# EAGLE design Conn_pcb (EAGLE 9.1.0)
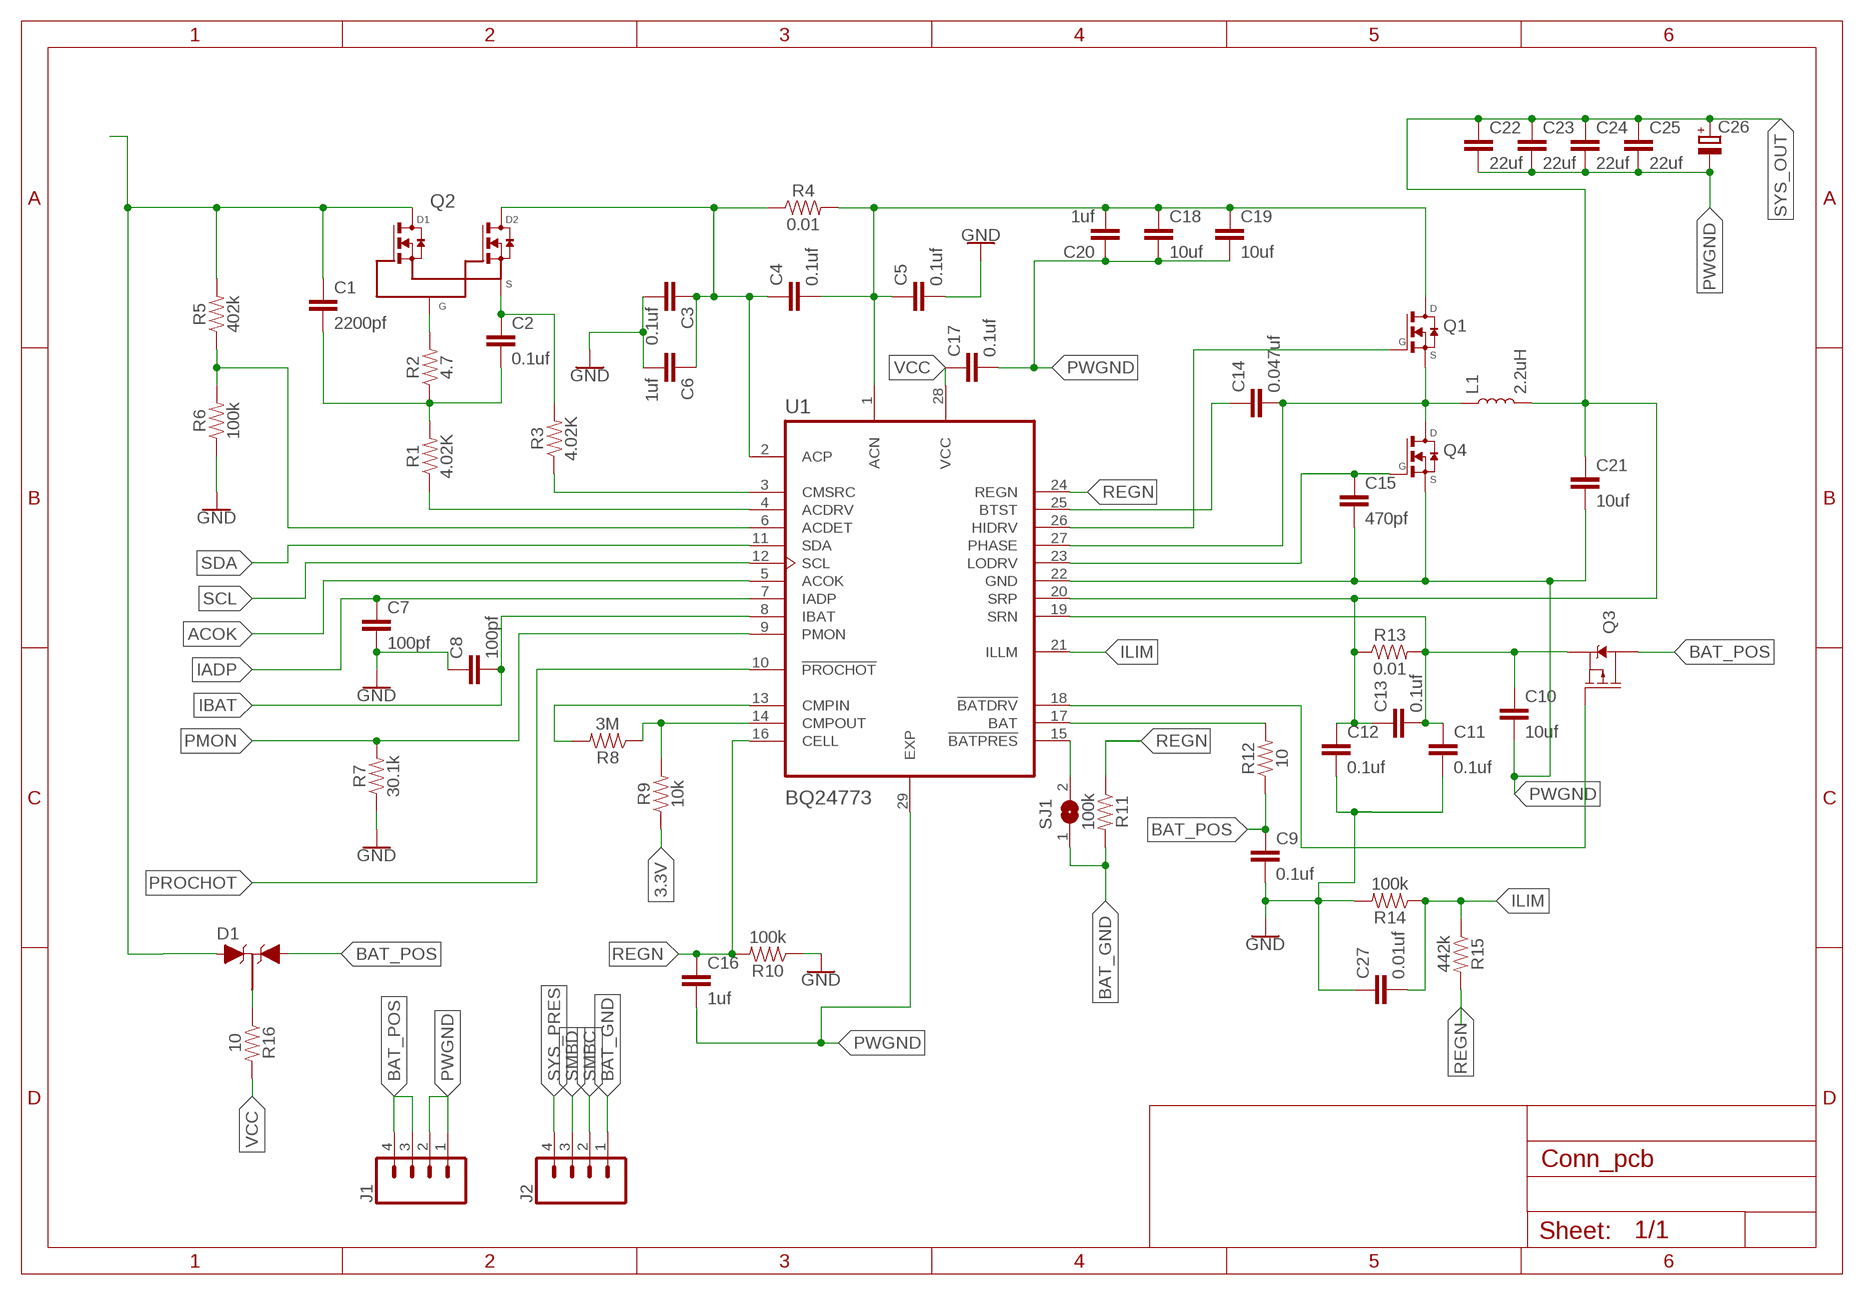
[diagram p0: schematic, sheet 1]

## Parts
C1  2200pf  CAP0402  [CAPC1005X50]
C2  0.1uf  CAP0402  [CAPC1005X50]
C3  0.1uf  CAP0402  [CAPC1005X50]
C4  0.1uf  CAP0402  [CAPC1005X50]
C5  0.1uf  CAP0402  [CAPC1005X50]
C6  1uf  CAP0402  [CAPC1005X50]
C7  100pf  CAP0402  [CAPC1005X50]
C8  100pf  CAP0402  [CAPC1005X50]
C9  0.1uf  CAP0402  [CAPC1005X50]
C10  10uf  C-EUC0805K  [C0805K]
C11  0.1uf  CAP0402  [CAPC1005X50]
C12  0.1uf  CAP0402  [CAPC1005X50]
C13  0.1uf  CAP0402  [CAPC1005X50]
C14  0.047uf  CAP0402  [CAPC1005X50]
C15  470pf  CAP0402  [CAPC1005X50]
C16  1uf  CAP0402  [CAPC1005X50]
C17  0.1uf  CAP0402  [CAPC1005X50]
C18  10uf  C-EUC0805K  [C0805K]
C19  10uf  C-EUC0805K  [C0805K]
C20  1uf  CAP0402  [CAPC1005X50]
C21  10uf  C-EUC0805K  [C0805K]
C22  22uf  C-EUC1206  [C1206]
C23  22uf  C-EUC1206  [C1206]
C24  22uf  C-EUC1206  [C1206]
C25  22uf  C-EUC1206  [C1206]
C26  CPOL-EUF  [PANASONIC_F]
C27  0.01uf  CAP0402  [CAPC1005X50]
D1  BAT54C-7-F  [SOT95P235X110-3]
J1  CONN_041.3  [1X04_NO_SILK_1.3]
J2  CONN_041.3  [1X04_NO_SILK_1.3]
L1  2.2uH  XEL6060-222MEB  [RESM6365X610]
Q1  CSD17308Q3  [SON65P330X330X110-8]
Q2  CSD87312Q3EVSON  [QFN65P330X330X100-12]
Q3  CSD25402Q3A  [CSD25402Q3A]
Q4  CSD17308Q3  [SON65P330X330X110-8]
R1  4.02K  RES4K04020402  [0402]
R2  4.7  RES4K04020402  [0402]
R3  4.02K  RES4K04020402  [0402]
R4  0.01  SENSE-RES  [1206]
R5  402k  RES4K04020402  [0402]
R6  100k  RES4K04020402  [0402]
R7  30.1k  RES4K04020402  [0402]
R8  3M  RES4K04020402  [0402]
R9  10k  RES4K04020402  [0402]
R10  100k  RES4K04020402  [0402]
R11  100k  RES4K04020402  [0402]
R12  10  RES4K04020402  [0402]
R13  0.01  SENSE-RES  [1206]
R14  100k  RES4K04020402  [0402]
R15  442k  RES4K04020402  [0402]
R16  10  RES4K04020402  [0402]
SJ1  SJ  [SJ]
U1  BQ24773  [QFN40P400X400X80-29T240]

## Nets
3.3V: R9.1
ACOK: U1.5(ACOK)
BAT_GND: J2.1 R11.2 SJ1.1
BAT_POS: C9.1 D1.2(A2) J1.3 J1.4 Q3.1(D) Q3.2(D) Q3.3(D) R12.1
GND: C3.2 C5.2 C6.2 C7.2 C8.1 C9.2 C11.2 C12.2 C27.1 R6.1 R7.1 R10.1 R14.2
IADP: C7.1 U1.7(IADP)
IBAT: C8.2 U1.8(IBAT)
ILIM: C27.2 R14.1 R15.1 U1.21(ILLM)
N$1: R1.1 U1.4(ACDRV)
N$2: C1.2 C2.2 R1.2 R2.1
N$3: Q2.5(G) R2.2
N$4: C1.1 D1.1(A1) Q2.1(D1) Q2.3(D1) Q2.4(D1) R5.2
N$5: R5.1 R6.2 U1.6(ACDET)
N$6: C4.2 C5.1 C18.1 C19.1 C20.2 Q1.5(D) Q1.6(D) Q1.7(D) Q1.8(D) R4.2 U1.1(ACN)
N$7: C2.1 Q2.9(S) Q2.9.1(S) Q2.9.2(S) Q2.9.3(S) Q2.9.4(S) R3.2
N$8: R3.1 U1.3(CMSRC)
N$9: C3.1 C4.1 C6.1 Q2.6(D2) Q2.7(D2) Q2.8(D2) R4.1 U1.2(ACP)
N$10: R8.2 U1.13(CMPIN)
N$11: R8.1 R9.2 U1.14(CMPOUT)
N$12: R12.2 U1.17(BAT)
N$13: Q3.4(G) U1.18(!BATDRV)
N$14: C10.1 C11.1 C13.2 Q3.5(S) Q3.6(S) Q3.7(S) Q3.8(S) Q3.9(S) R13.2 U1.19(SRN)
N$15: C15.1 Q4.4(G) U1.23(LODRV)
N$16: SJ1.2 U1.15(!BATPRES)
N$17: D1.3(K) R16.1
N$18: C14.2 L1.1 Q1.1(S) Q1.2(S) Q1.3(S) Q4.5(D) Q4.6(D) Q4.7(D) Q4.8(D) U1.27(PHASE)
N$19: C14.1 U1.25(BTST)
N$20: Q1.4(G) U1.26(HIDRV)
PMON: R7.2 U1.9(PMON)
PROCHOT: U1.10(!PROCHOT)
PWGND: C10.2 C15.2 C16.2 C17.2 C18.2 C19.2 C20.1 C21.2 C22.2 C23.2 C24.2 C25.2 C26.- J1.1 J1.2 Q4.1(S) Q4.2(S) Q4.3(S) U1.22(GND) U1.29(EXP)
REGN: C16.1 R10.2 R11.1 R15.2 U1.16(CELL) U1.24(REGN)
SCL: U1.12(SCL)
SDA: U1.11(SDA)
SMBC: J2.2
SMBD: J2.3
SYS_OUT: C12.1 C13.1 C21.1 C22.1 C23.1 C24.1 C25.1 C26.+ L1.2 R13.1 U1.20(SRP)
SYS_PRES: J2.4
VCC: C17.1 R16.2 U1.28(VCC)

## Library data of the parts
C1-C9 C11-C17 C20 C27 = BMS:CAP0402
C10 C18 C19 C21-C25 = rcl:C-EU: CAPACITOR, European symbol; SPICEPREFIX: C
C26 = rcl:CPOL-EU: POLARIZED CAPACITOR, European symbol; SPICEPREFIX: C
D1 = BMS:BAT54C-7-F
J1 J2 = SparkFun-Connectors:CONN_04: Multi connection point. Often used as Generic Header-pin footprint for 0.1 inch spaced/style header connections On any of the 0.1 inch spaced packages, you can populate with these: Break Away Headers - Straight <https://www.sparkfun.com/products/116> (PRT-00116) Break Away Male Headers - Right Angle <https://www.sparkfun.com/products/553> (PRT-00553) Female Headers <https://www.sparkfun.com/products/115> (PRT-00115) Break Away Headers - Machine Pin <https://www.sparkfun.com/products/117> (PRT-00117) Break Away Female Headers - Swiss Machine Pin <https://www.sparkfun.com/products/743> (PRT-00743) For SCREWTERMINALS and SPRING TERMINALS visit here: Screw Terimnals on SparkFun.com <https://www.sparkfun.com/search/results?term=Screw+Terminals> (5mm/3.5mm/2.54mm spacing) This device is also useful as a general connection point to wire up your design to another part of your project. Our various solder wires solder well into these plated through hole pads. Hook-Up Wire - Assortment (Stranded, 22 AWG) <https://www.sparkfun.com/products/11375> (PRT-11375) Hook-Up Wire - Assortment (Solid Core, 22 AWG) <https://www.sparkfun.com/products/11367> (PRT-11367) View the entire wire category on our website here <https://www.sparkfun.com/categories/141> Special notes: Molex polarized connector foot print use with SKU : PRT-08231 with associated crimp pins and housings. 1MM SMD Version SKU: PRT-10208
L1 = BMS:XEL6060-222MEB
Q1 Q4 = BMS:CSD17308Q3; SPICEPREFIX: Q
Q2 = BMS:CSD87312Q3E
Q3 = CSD25402Q3A:CSD25402Q3A; MANUFACTURER_PART_NUMBER: CSD25402Q3A; VENDOR: Texas Instruments
R1-R3 R5-R12 R14-R16 = BMS:RES4K0402
R4 R13 = BMS:SENSE-RES
SJ1 = jumper:SJ: SMD solder JUMPER
U1 = BMS:BQ24773

## Board
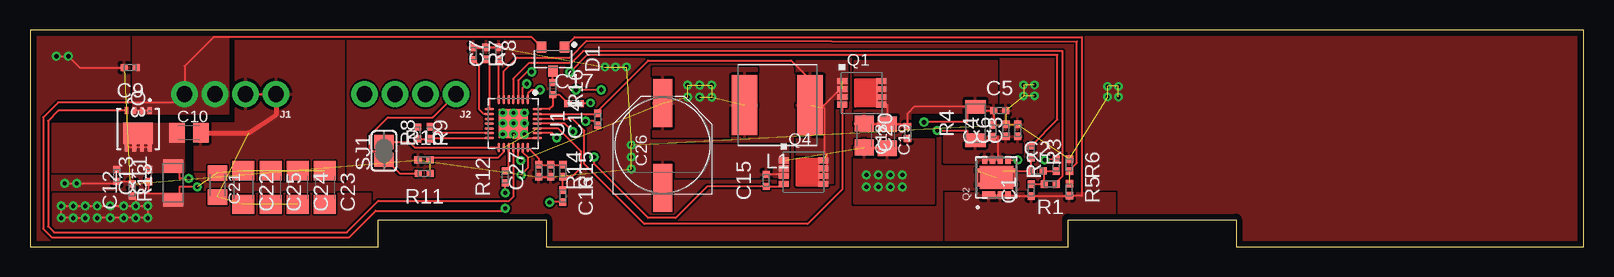
[diagram p1: board, top side]
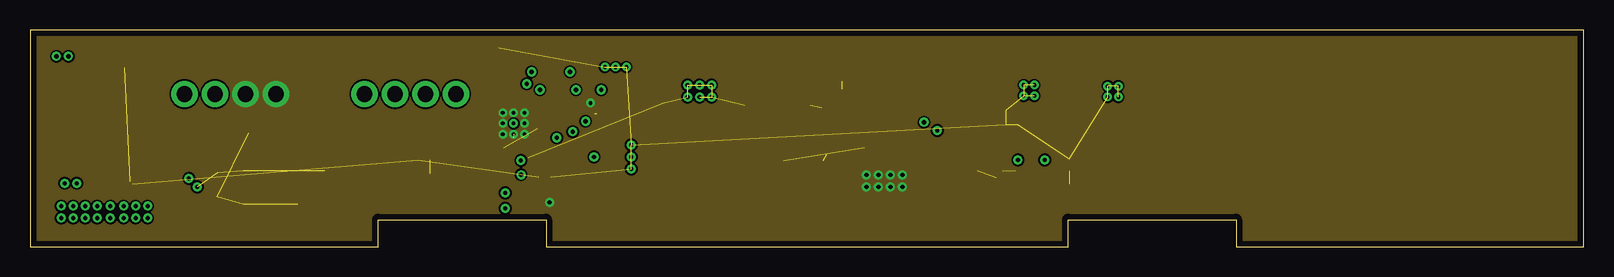
[diagram p2: board, inner layer Route2]
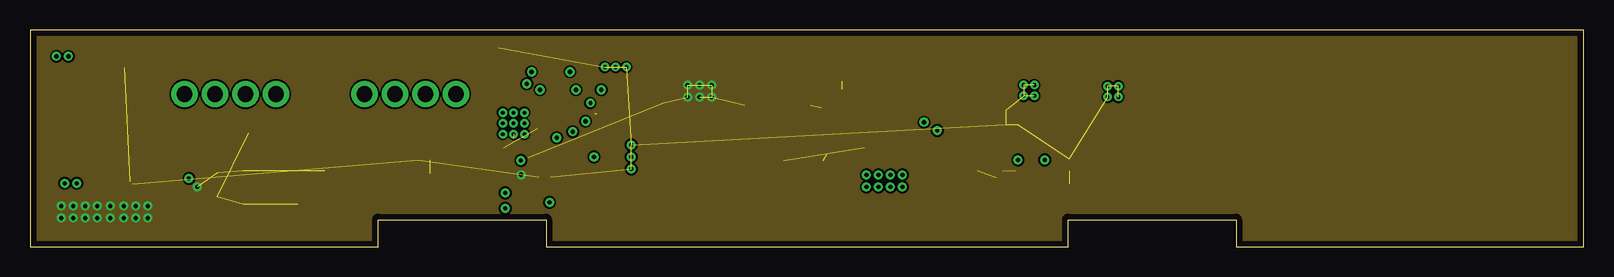
[diagram p3: board, inner layer Route15]
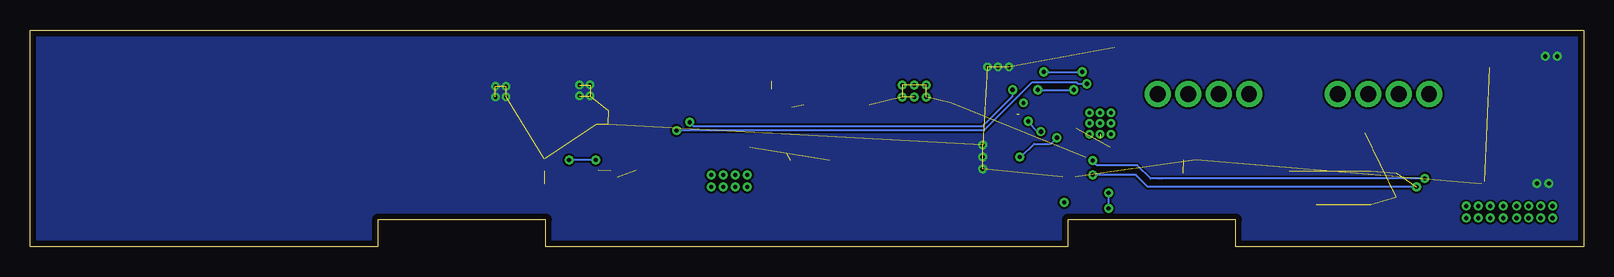
[diagram p4: board, bottom side, seen from below]

Size 129.48 x 18.1 mm. Coordinates in mm from the lower left corner, seen from the top.
Outline: 0,0 29,0 29,2.25 43,2.25 43,0 86.5,0 86.5,2.25 100.5,2.25 100.5,0 129.48,0 129.48,18.1 0,18.1 0,0
Copper layers (1+2*15+16): Top 0.07mm / dielectric 0.15mm / Route2 0.07mm / dielectric 0.3mm / Route15 0.07mm / dielectric 0.15mm / Bottom 0.07mm
Design rules "default *": minimum track width 6mil, minimum drill 0.3mm, track to track 6mil, track to pad 6mil, pad to pad 6mil, via to via 6mil, smd to smd 6mil, copper to edge 20mil, drill to drill 6mil, minimum pad ring 10mil, minimum via ring 8mil, stop-mask expansion 0.07mm, vias tented up to drill 0mil, thermal gap 10mil

### Footprints (pad centres in the part's own frame; a part is rotated, then mirrored left to right if it is on the bottom)
CAPC1005X50 = smd 0.6 x 0.6: 1 -0.5,0; 2 0.5,0
C0805K = smd 1.3 x 1.6: 1 -1,0; 2 1,0
C1206 = smd 1.6 x 1.8: 1 -1.4,0; 2 1.4,0
PANASONIC_F = smd 4 x 1.6: + 3.55,0; - -3.55,0
SOT95P235X110-3 = smd 0.9 x 0.8: 1 -1,0.95; 2 -1,-0.95; 3 1,0
1X04_NO_SILK_1.3 = drill 1.3 pad 2.184: 1 0,0; 2 2.54,0; 3 5.08,0; 4 7.62,0
RESM6365X610 = smd 2.115 x 5.012: 1 -2.73,0; 2 2.73,0
SON65P330X330X110-8 = smd 0.5 x 0.83: 1 -0.975,-1.635; 2 -0.325,-1.635; 3 0.325,-1.635; 4 0.975,-1.635; 5 0.975,1.635; 6 0.325,1.635; 7 -0.325,1.635; 8 -0.975,1.635
QFN65P330X330X100-12 = smd 0.65 x 1.09: 1 -1.475,0.65 | smd 0.65 x 0.44: 3 -1.475,-0.325; 4 -1.475,-0.975; 5 1.475,-0.975; 6 1.475,-0.325; 7 1.475,0.325; 8 1.475,0.975 | smd 1.9 x 2.8: 9 0,0 | smd 0.3 x 0.35: 9.1 -0.59,1.575; 9.2 0.59,1.575; 9.3 -0.59,-1.575; 9.4 0.59,-1.575
CSD25402Q3A = smd 0.61 x 0.305: 1 -1.549,0.975; 2 -1.549,0.325; 3 -1.549,-0.325; 4 -1.549,-0.975; 5 1.549,-0.975; 6 1.549,-0.325; 7 1.549,0.325; 8 1.549,0.975 | smd 1.778 x 2.438: 9 0.356,0
0402 = smd 0.6 x 0.6: 1 -0.5,0; 2 0.5,0
1206 = smd 1.131 x 1.67: 1 -1.395,0; 2 1.395,0
SJ = smd 1.168 x 1.6: 1 -0.762,0; 2 0.762,0
QFN40P400X400X80-29T240 = smd 0.8 x 0.2: 1 -2,1.2; 2 -2,0.8; 3 -1.999,0.398; 4 -1.997,0; 5 -2,-0.4; 6 -2,-0.8; 7 -2,-1.2; 15 2,-1.2; 16 2,-0.8; 17 2,-0.4; 18 2,0; 19 2,0.4; 20 2,0.8; 21 2,1.2 | smd 0.2 x 0.8: 8 -1.2,-2; 9 -0.8,-2; 10 -0.4,-2; 11 0,-2; 12 0.4,-2; 13 0.8,-2; 14 1.2,-2; 22 1.2,2; 23 0.8,2; 24 0.4,2; 25 0,2; 26 -0.4,2; 27 -0.8,2; 28 -1.2,2 | smd 2.4 x 2.4: 29 0,0

### Placement (x,y rotation side)
C1  83.43,4.73 90 top
C2  83.94,6.32 0 top
C3  82.3,9.72 90 top
C4  80.23,9.68 90 top
C5  80.8,11.37 0 top
C6  81.33,9.72 90 top
C7  39.08,16.14 90 top
C8  38,16.15 270 top
C9  8.36,14.96 180 top
C10  13.24,9.51 0 top
C11  7.23,5.96 270 top
C12  8.52,4.74 90 top
C13  9.87,5.94 90 top
C14  47.3,10.64 90 top
C15  61.35,5.54 90 top
C16  44.4,4.23 270 top
C17  45.34,11.95 0 top
C18  69.52,9.29 270 top
C19  71.43,9.24 270 top
C20  73.13,9.54 90 top
C21  15.62,5.15 270 top
C22  17.77,4.95 270 top
C23  24.56,4.95 270 top
C24  22.31,4.95 270 top
C25  20.06,4.95 270 top
C26  52.72,8.46 90 top
C27  42.39,6.35 90 top
D1  43.58,15.67 270 top
J1  20.5,12.75 180 top
J2  35.5,12.75 180 top
L1  62.28,11.82 180 top
Q1  69.32,12.84 270 top
Q2  80.53,5.78 90 top
Q3  9.01,9.82 270 top
Q4  64.45,6.22 270 top
R1  85.02,5.23 180 top
R2  85.53,6.81 90 top
R3  83.42,7.91 270 top
R4  78.79,10.3 90 top
R5  86.62,4.76 270 top
R6  86.62,6.81 270 top
R7  36.93,16.13 270 top
R8  33.36,9.51 90 top
R9  32.29,9.49 270 top
R10  32.84,7.24 0 top
R11  32.86,6.11 180 top
R12  39.61,5.84 90 top
R13  11.94,5.34 90 top
R14  43.4,6.35 270 top
R15  44.41,6.35 270 top
R16  43.56,13.2 270 top
SJ1  29.5,8 90 top
U1  40.28,10.28 270 top

### Tracks (layer width: path | path; a pad name or v marks a point on that pad's centre or on a via)
BAT_GND
  Top 0.152: 29,7.24 SJ1.1 | R11.2 30.83,6.11 29.7,7.24 SJ1.1 | SJ1.1 28.79,7.95 28.61,7.95 28.3,8.25 28.3,9.27 29.83,10.8 33.55,10.8 J2.1
BAT_POS  (via drill 0.35)
  Top 0.152: Q3.1 Q3.2 Q3.3 | D1.2 41.8,17.5 15.3,17.5 12.88,15.08 J1.4 12.18,12.05 2.35,12.05 1.1,10.8 1.1,1.5 1.82,0.78 26.58,0.78 28.8,3 39.4,3 v39.6,3.2 | v39.6,4.5 R12.1
  Bottom 0.152: v39.6,3.2 v39.6,4.5
  pour Top (no thermals): 8.6,19.8 16.5,19.8 16.5,11.1 8.6,11.1
GND  (via drill 0.3, 0.35)  (22 unrouted)
  Top 0.152: R7.1 37.98,16.63 C8.1 C7.2 | v2.9,5.3 v3.9,5.3 7.07,5.3 C11.2 8.3,5.46 C12.2 | v2.2,15.9 v3.2,15.9 4.14,14.96 C9.2 | C27.1 R14.2
  other vias: 49.7,15 82.8,13.5 83.7,13.5 83.7,12.6 82.8,12.6 89.8,13.4 90.7,13.4 90.7,12.5 89.8,12.5 48.8,15 47.9,15 50.1,8.5 50.1,7.5 50.1,6.5
  pour Top (rank 6): -7.1,22.2 -7.1,-8.1 138.3,-8.1 138.3,22.2
  pour Bottom: -9.4,28.5 -9.4,-1.5 134,-1.5 134,28.5
IADP
  Top 0.152: U1.7 C7.1
IBAT
  Top 0.152: U1.8 38.28,15.37 C8.2
ILIM
  Top 0.152: U1.21 42.39,7.37 C27.2 R14.1 R15.1
N$1
  Top 0.152: R1.1 85.52,5.38 86.06,5.92 86.06,16.35 46.1,16.35 45.1,15.35 41.58,15.35 40.27,14.04 40.27,12.29 U1.4
N$2
  Top 0.152: C1.2 R1.2 84.52,6.24 C2.2 R2.1
N$3  (via drill 0.35)
  Top 0.152: Q2.5 82.28,7.25 v82.33,7.25 | v84.56,7.25 84.62,7.31 R2.2
  Bottom 0.152: v82.33,7.25 v84.56,7.25
N$4
  Top 0.152: Q2.1 Q2.3 Q2.4 81.58,4.23 C1.1 86.5,4.23 | 86.5,4.23 86.59,4.23 R5.2 | D1.1 45.38,17.52 87.65,17.52 87.65,4.23 86.5,4.23
  pour Top: 76.3,4.5 90.4,4.5 90.4,-0.4 76.3,-0.4
N$5  (1 unrouted)
  Top 0.152: R6.2 86.62,6.39 87.25,7.01 87.25,17.14 46.4,17.2 45,15.8 40.6,15.8 39.48,14.68 U1.6
N$6  (via drill 0.35)
  Top 0.152: R4.2 78.79,11.37 C5.1 80.3,10.18 C4.2 | C19.1 69.57,10.24 C18.1 | C19.1 73.13,10.24 C20.2 73.13,11.14 73.73,11.74 78.75,11.74 R4.2 | Q1.5 71.43,11.87 C19.1 | v74.5,10.4 78.09,10.4 78.09,10.9 78.09,11.29 78.49,11.69 R4.2 | v42.5,13.1 41.8,13.1 41.48,12.78 U1.1 | v47.6,13.1 v45.5,13.1
  Bottom 0.152: v45.5,13.1 v42.5,13.1 | v47.6,13.1 47.6,12.6 50.1,10.1 74.2,10.1 v74.5,10.4
  pour Top: 68.7,15.5 68.7,9.8 73.4,9.8 73.4,11.2 80,11.2 80,9.9 80.6,9.9 80.6,15.5
N$7  (2 unrouted)
  Top 0.152: Q2.9.3 Q2.9.4 | Q2.9.2 Q2.9.1 | Q2.9 81.07,6.32 C2.1 83.44,7.39 R3.2
N$8  (via drill 0.35)
  Top 0.152: v45,14.6 46.4,16 85.62,16 85.62,10.61 R3.1 | U1.3 40.68,13.88 41.4,14.6 v41.8,14.6
  Bottom 0.152: v45,14.6 v41.8,14.6
N$9  (via drill 0.35)
  Top 0.152: Q2.8 Q2.7 Q2.6 80.86,7.36 80.66,7.55 80.66,9.18 C4.1 80.23,8.9 R4.1 78.29,8.9 78.09,9.11 78.09,9.7 v75.6,9.7 | U1.2 41.08,13.28 v41.4,13.6
  Bottom 0.152: v41.4,13.6 42.14,13.6 42.25,13.71 45.99,13.71 50,9.7 v75.6,9.7
  pour Top: 81,7 76.2,7 76.2,9.4 81,9.4 82.6,9.4 82.6,7.8 81,7.8
N$10
  Top 0.152: U1.13 33.89,9.48 R8.2
N$11
  Top 0.152: U1.14 33.42,9.07 R8.1 33.34,8.99 R9.2
N$12
  Top 0.152: R12.2 39.88,6.61 U1.17
N$13
  Top 0.152: Q3.4 2.37,11.37 1.5,10.5 1.5,1.7 2,1.2 26.4,1.2 29.04,3.84 39.94,3.84 40.3,4.2 40.3,8.26 U1.18
N$14  (via drill 0.35)
  Top 0.152: Q3.8 Q3.7 Q3.6 Q3.5 | v40.91,7.2 40.68,7.43 U1.19 | v13.24,5.7 12.44,5.7 12.44,6.43 12.14,6.73 R13.2
  Bottom 0.152: v13.24,5.7 35.2,5.7 | 35.2,5.7 35.4,5.7 | v40.91,7.2 40.91,7.11 40.6,6.8 37.2,6.8 36.1,5.7 35.2,5.7
  pour Top (no thermals): 1.9,10.3 12.8,10.3 12.8,6.2 1.9,6.2
N$15  (via drill 0.35)
  Top 0.152: v47,7.5 47,6.9 51.5,2.4 53.8,2.4 56.44,5.04 C15.1 62.81,5.04 Q4.4 | v43.9,9.1 43.52,9.48 U1.23
  Bottom 0.152: v47,7.5 46.9,7.5 45.8,8.6 44.4,8.6 v43.9,9.1
N$16
  Top 0.152: SJ1.2 31.59,8.76 32.08,8.28 U1.15
N$17
  Top 0.152: R16.1 43.58,13.72 D1.3
N$18  (5 unrouted)
  Top 0.152: Q4.5 Q4.6 Q4.7 66.39,6.54 66.39,7.69 66.21,7.88 66.21,11.62 65.99,11.62 67.69,13.31 67.48,12.96 67.48,12.77 67.48,12.56 67.64,12.56 Q1.3 | U1.27 47.24,11.08 C14.2 | 47.06,11.08 51.52,15.54 63.43,15.54 65.01,13.96 L1.1
  pour Top: 63.9,15.53 68.1,15.53 68.1,12.3 66.9,12.3 66.9,5.3 63.9,5.3
N$19  (via drill 0.35)
  Top 0.152: C14.1 46.94,10.5 46.3,10.5 v46.3,10.47 | v45.23,9.61 44.56,10.28 U1.25
  Bottom 0.152: v46.3,10.47 46.3,10.4 45.5,9.6 45.49,9.61 v45.23,9.61
N$20
  Top 0.152: U1.26 45.22,10.68 46.2,9.7 46.2,6.9 51.2,1.9 64.8,1.9 67.69,4.79 Q1.4
N$25  (via drill 0.3)
  other vias: 40.3,10.3
PMON
  Top 0.152: U1.9 37.82,11.08 37.43,11.47 37.43,15.13 R7.2
PWGND  (via drill 0.3, 0.35)  (6 unrouted)
  Top 0.152: C15.2 62.81,6.04 Q4.3 | C18.2 71.43,8.29 C19.2 | J1.2 J1.1 | U1.29 40.28,9.08 U1.22 | C17.2 45.84,12 v46.7,12 | C16.2 43.33,3.73 v43.3,3.7
  Top 0.406: C10.2 18.21,9.51 20.5,11.01 J1.1
  other vias: 39.4,11.2 39.4,10.3 40.3,11.2 41.2,11.2 41.2,10.3 39.4,9.4 40.3,9.4 41.2,9.4 69.7,6 70.7,6 71.7,6 72.7,6 70.7,5 69.7,5 71.7,5 72.7,5
  pour Route2 (no thermals): -8.6,24 135.8,24 135.8,-6.2 -8.6,-6.2
  pour Top: 52,8.5 63.2,8.5 63.2,5.8 52,5.8 52,6
  pour Top: 17.1,19.8 17.1,10.3 13.7,10.3 13.7,6.4 13.9,6.4 14.9,6.4 14.9,5.6 26.2,5.6 26.2,19.8
  pour Top: 68.7,9 75.3,9 75.3,3.6 68.7,3.6
REGN  (2 unrouted)
  Top 0.152: U1.24 42.31,9.91 43.97,9.91 45.9,7.98 45.9,6.6 45.15,5.85 R15.2 C16.1 | U1.16 39.48,7.91 39.02,7.45 33.55,7.45 R10.2
SYS_OUT  (via drill 0.35)  (13 unrouted)
  Top 0.152: 9.9,4.45 8.73,4.45 C12.1 8.8,3.96 v8.8,3.4 | 9.9,4.45 11.44,4.45 R13.1 12.44,4.45 12.44,5 v13.94,5 | U1.20 41.08,7.88 41.51,7.45 41.51,6.6 v40.92,6.01 | C13.1 9.87,4.48 9.9,4.45 | v4.6,2.4 v3.6,2.4 v2.6,2.4 v2.6,3.4 v3.6,3.4 v4.6,3.4 v5.6,3.4 v6.7,3.4 v7.8,3.4 v8.8,3.4 | v8.8,3.4 v9.8,3.4 v9.8,2.4 v8.8,2.4 v7.8,2.4 v6.7,2.4 v5.6,2.4
  Bottom 0.152: v13.94,5 36.33,5 37.33,6 v40.91,6 v40.92,6.01
  other vias: 54.8,13.5 55.8,13.5 56.8,13.5 54.8,12.5 55.8,12.5 56.8,12.5
  pour Top (no thermals): 28.4,4.4 1.9,4.4 1.9,1.8 2.1,1.6 28.4,1.6
  pour Top: 51.9,14.9 51.9,9.2 60.6,9.2 60.6,14.9
  pour Route15: -11.9,26.9 134.9,26.9 134.9,-6.2 -11.9,-6.2
VCC
  Top 0.152: U1.28 43.28,11.48 43.56,11.76 R16.2 44.09,12.7 C17.1